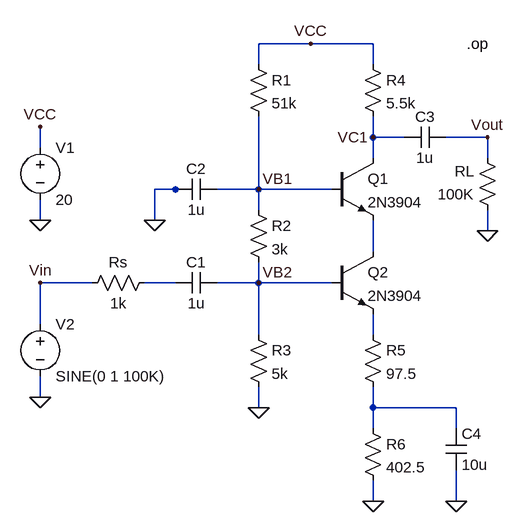
[diagram p0: schematic 2N3904_cascode.asc]
2N3904_cascode.asc, the LTspice schematic file:
Version 4
SHEET 1 984 680
WIRE 432 -176 352 -176
WIRE 528 -176 432 -176
WIRE 352 -144 352 -176
WIRE 528 -144 528 -176
WIRE 528 -32 528 -64
WIRE 576 -32 528 -32
WIRE 704 -32 640 -32
WIRE 16 -16 16 -48
WIRE 528 0 528 -32
WIRE 704 0 704 -32
WIRE 224 48 192 48
WIRE 240 48 224 48
WIRE 352 48 352 -64
WIRE 352 48 288 48
WIRE 464 48 352 48
WIRE 352 80 352 48
WIRE 16 96 16 64
WIRE 192 96 192 48
WIRE 704 112 704 80
WIRE 528 144 528 96
WIRE 96 192 16 192
WIRE 224 192 176 192
WIRE 352 192 352 160
WIRE 352 192 288 192
WIRE 464 192 352 192
WIRE 16 256 16 192
WIRE 352 272 352 192
WIRE 528 272 528 240
WIRE 16 368 16 336
WIRE 352 384 352 352
WIRE 528 384 528 352
WIRE 656 384 528 384
WIRE 528 416 528 384
WIRE 656 416 656 384
WIRE 528 528 528 496
WIRE 656 528 656 480
FLAG 16 96 0
FLAG 16 -48 VCC
FLAG 528 528 0
FLAG 656 528 0
FLAG 432 -176 VCC
FLAG 16 368 0
FLAG 192 96 0
FLAG 352 384 0
FLAG 704 112 0
FLAG 352 48 VB1
FLAG 352 192 VB2
FLAG 704 -32 Vout
FLAG 16 192 Vin
FLAG 528 -32 VC1
SYMBOL voltage 16 -32 R0
WINDOW 123 0 0 Left 0
WINDOW 39 0 0 Left 0
SYMATTR InstName V1
SYMATTR Value 20
SYMBOL res 336 -160 R0
SYMATTR InstName R1
SYMATTR Value 51k
SYMBOL res 512 -160 R0
SYMATTR InstName R4
SYMATTR Value 5.5k
SYMBOL res 336 64 R0
SYMATTR InstName R2
SYMATTR Value 3k
SYMBOL res 336 256 R0
SYMATTR InstName R3
SYMATTR Value 5k
SYMBOL npn 464 0 R0
SYMATTR InstName Q1
SYMATTR Value 2N3904
SYMBOL npn 464 144 R0
SYMATTR InstName Q2
SYMATTR Value 2N3904
SYMBOL res 512 256 R0
SYMATTR InstName R5
SYMATTR Value 97.5
SYMBOL res 512 400 R0
SYMATTR InstName R6
SYMATTR Value 402.5
SYMBOL cap 640 416 R0
SYMATTR InstName C4
SYMATTR Value 10u
SYMBOL cap 288 32 R90
WINDOW 0 0 32 VBottom 2
WINDOW 3 32 32 VTop 2
SYMATTR InstName C2
SYMATTR Value 1u
SYMBOL cap 288 176 R90
WINDOW 0 0 32 VBottom 2
WINDOW 3 32 32 VTop 2
SYMATTR InstName C1
SYMATTR Value 1u
SYMBOL res 192 176 R90
WINDOW 0 0 56 VBottom 2
WINDOW 3 32 56 VTop 2
SYMATTR InstName Rs
SYMATTR Value 1k
SYMBOL voltage 16 240 R0
WINDOW 123 0 0 Left 0
WINDOW 39 0 0 Left 0
SYMATTR InstName V2
SYMATTR Value SINE(0 1 100K)
SYMBOL cap 576 -16 R270
WINDOW 0 32 32 VTop 2
WINDOW 3 0 32 VBottom 2
SYMATTR InstName C3
SYMATTR Value 1u
SYMBOL res 720 96 R180
WINDOW 0 36 76 Left 2
WINDOW 3 36 40 Left 2
SYMATTR InstName RL
SYMATTR Value 100K
TEXT 672 -176 Left 2 !.op

The netlist it stands for:
* 2N3904_cascode.asc
V1 VCC 0 20
R1 VCC VB1 51k
R4 VCC VC1 5.5k
R2 VB1 VB2 3k
R3 VB2 0 5k
Q1 VC1 VB1 N001 0 2N3904
Q2 N001 VB2 N003 0 2N3904
R5 N003 N004 97.5
R6 N004 0 402.5
C4 N004 0 10u
C2 VB1 0 1u
C1 VB2 N002 1u
Rs N002 Vin 1k
V2 Vin 0 SINE(0 1 100K)
C3 VC1 Vout 1u
RL 0 Vout 100K
.model NPN NPN
.model PNP PNP
.lib standard.bjt
.op
.backanno
.end